# Altium schematic sheet Sensor.SchDoc
size A; SheetNumber: 6; SheetTotal: 7
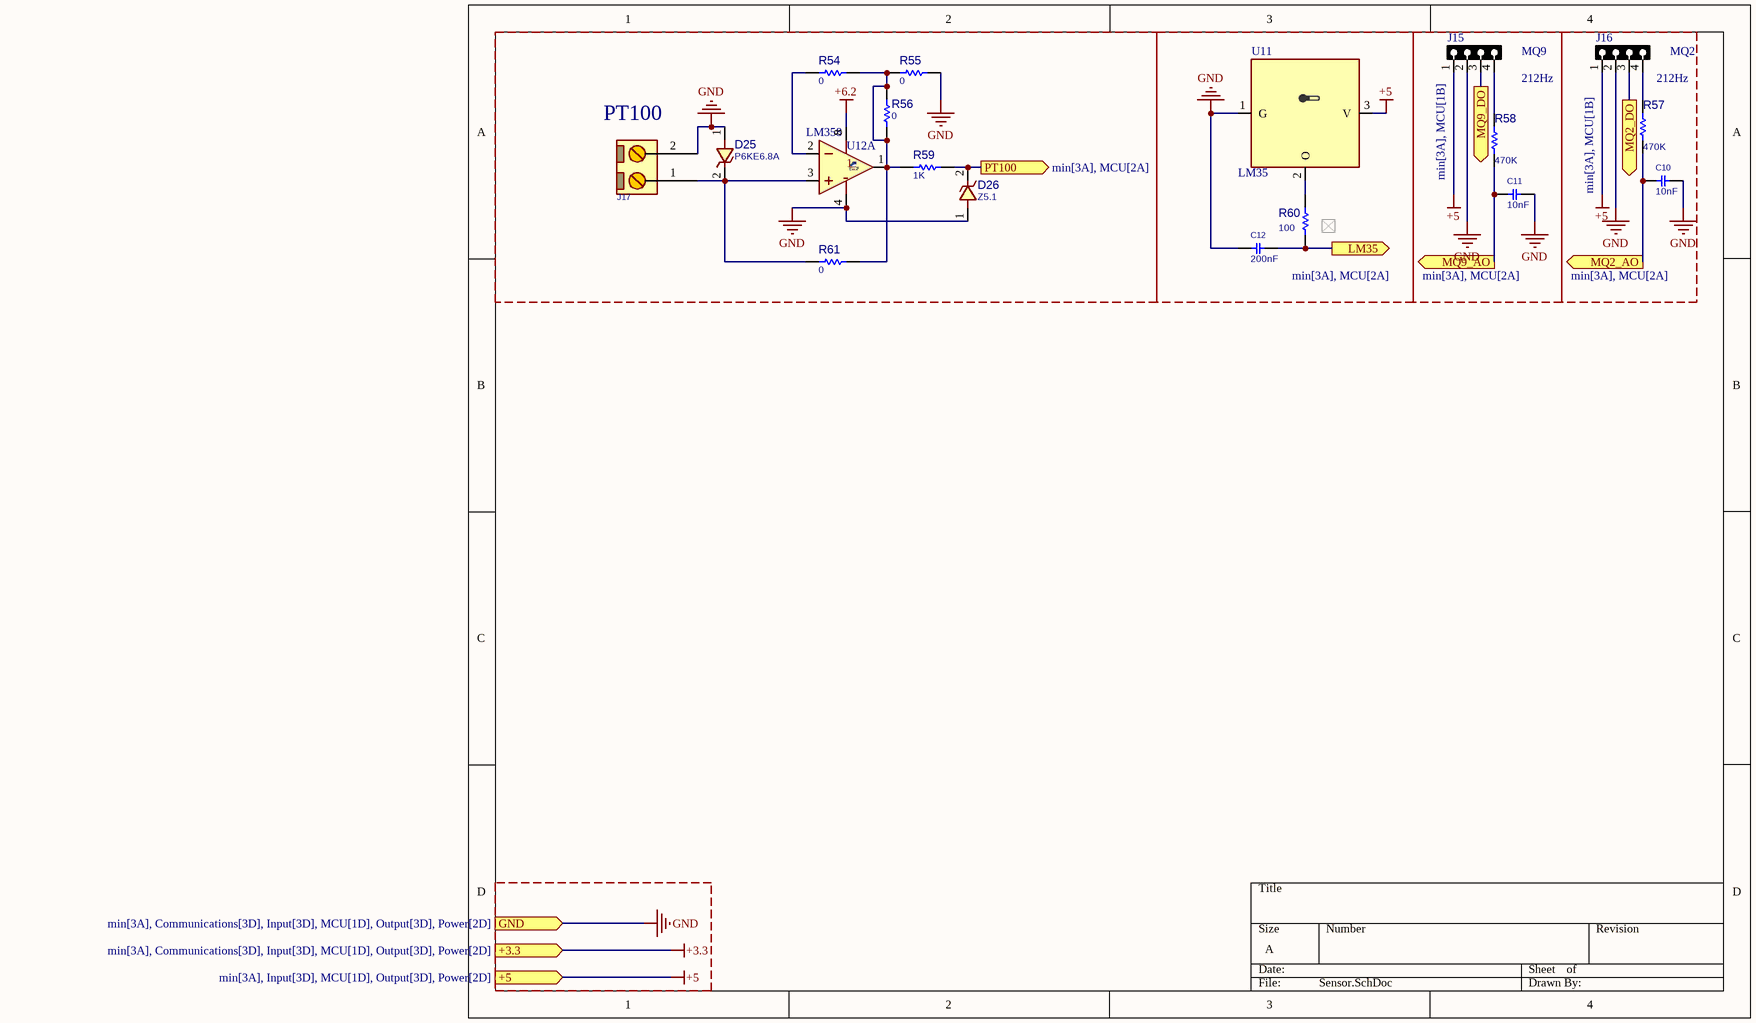
[diagram p0: Sensor.SchDoc]

## Parts
C10  10nF  [C1206]
C11  10nF  [C1206]
C12  200nF  [C1206]
D25  P6KE6.8A  [D_AX04_DO41]
D26  Z5.1  [D_AX04_DO41]
J15  MQ9  [HDR_F_1X4]
J16  MQ2  [HDR_F_1X4]
J17  CONN_GMSTB2  [GMSTB762_2]  (value not drawn)
R54  0  [R1206]
R55  0  [R1206]
R56  0  [R1206]
R57  470K  [R1206]
R58  470K  [R1206]
R59  1K  [R1206]
R60  100  [R1206]
R61  0  [R1206]
U11  LM35  [TO92_3]
U12  LM358  [DIP_8]  (part A of 2)

## Ports
+3.3 (in, see min[3A], Communications[3D], Input[3D], MCU[1D], Output[3D], Power[2D]), +5 (in, see min[3A], Input[3D], MCU[1D], Output[3D], Power[2D]), GND (in, see min[3A], Communications[3D], Input[3D], MCU[1D], Output[3D], Power[2D]), LM35 (out, see min[3A], MCU[2A]), MQ2_AO (out, see min[3A], MCU[2A]), MQ2_DO (out, see min[3A], MCU[1B]), MQ9_AO (out, see min[3A], MCU[2A]), MQ9_DO (out, see min[3A], MCU[1B]), PT100 (out, see min[3A], MCU[2A])

## Nets
+3.3: port +3.3
+5: J15.1 J16.1 U11.3(V) ; port +5
+6.2: U12.8(V+)
GND: C10.2 C11.2 C12.1 D25.1 D26.1 J15.2 J16.2 J17.2 R55.1 U11.1(G) U12.4(V-) ; port GND
LM35: C12.2 R60.1 ; port LM35
MQ2_AO: C10.1 R57.1 ; port MQ2_AO
MQ2_DO: J16.3 ; port MQ2_DO
MQ9_AO: C11.1 R58.1 ; port MQ9_AO
MQ9_DO: J15.3 ; port MQ9_DO
PT100: D26.2 R59.2 ; port PT100
NetD25_2: D25.2 J17.1 R61.2 U12.3(IN+)
NetJ15_4: J15.4 R58.2
NetJ16_4: J16.4 R57.2
NetR54_1: R54.1 R55.2 R56.1 R56.2 R59.1 R61.1 U12.1(OUT)
NetR54_2: R54.2 U12.2(IN-)
NetR60_2: R60.2 U11.2(O)

## Notes on the sheet
- 212Hz
- (near J17) PT100

## Library data of the parts
C10-C12 = CAP_SMD_MLCC: CAP, MLCC; PARAM: C0G, 10%; DESC: CAP, MLCC, 1nF, 50V, C0G, 10%, 0402; MANF_P#: MANF_PART#; MANF: Murata; PARAM2: 50V; VALUE: 20pF; PRICE: 100= 1$; ASSEMBLY: ASSEMBLY
D25 D26 = DIODE_THD_ZENER: DIODE, ZENER, 0.2W, 15V; MANF: Diodes; DESC: DESCRIPTION; MANF_P#: ZENER15V; ASSEMBLY: ASSEMBLY; PRICE: PRICE; PARAM2: 0.2W; PARAM: 15V
  D25: VALUE: P6KE6.8A
  D26: VALUE: Z5.1
J15 J16 = HDR_F_1X4: CONN, HEADER, Female, pitch: 2.54mm, 4POS; VALUE: HDRF4
J17 = CONN_GMSTB762_2: CONN, PHOENIX GMSTB, 7.62mm pitch; MANF_P#: GMSTB 2,5/2-G-7,62; PARAM2: 630V; PARAM: 12A; VALUE: CONN_GMSTB2
R54-R61 = RES_SMD: RESISTOR, SMD; PARAM: -W; DESC: DESCRIPTION; DIST#: MOUSER; PARAM2: 1%; VALUE: 470; MANF_P#: -; MANF: -; ASSEMBLY: ASSEMBLY; PRICE: 100= 0.5$
U11 = TMP_LM35_TO92: SENSOR, TEMP, ANALOG, -55~150oC, 4~20Vcc, Out 0mV + 10mV/oC; MANF_P#: LM35CZ, LM35CAZ or LM35DZ; MANF: TI; PARAM: 0.5°C Accuracy, 10mV/oC, -55~150oC; PARAM2: 4~20Vcc; PRICE: 7$; VALUE: LM35
U12 = LM358_DIP8: AMP, Dual, Low-Power; MANF: Texas Instruments, Fairchild; MANF_P#: LM358AN; PARAM2: 3 V ~ 32 V, ±1.5 V ~ 16 V; PRICE: -; VALUE: LM358